# Altium schematic sheet [1]MCU.SchDoc
size B
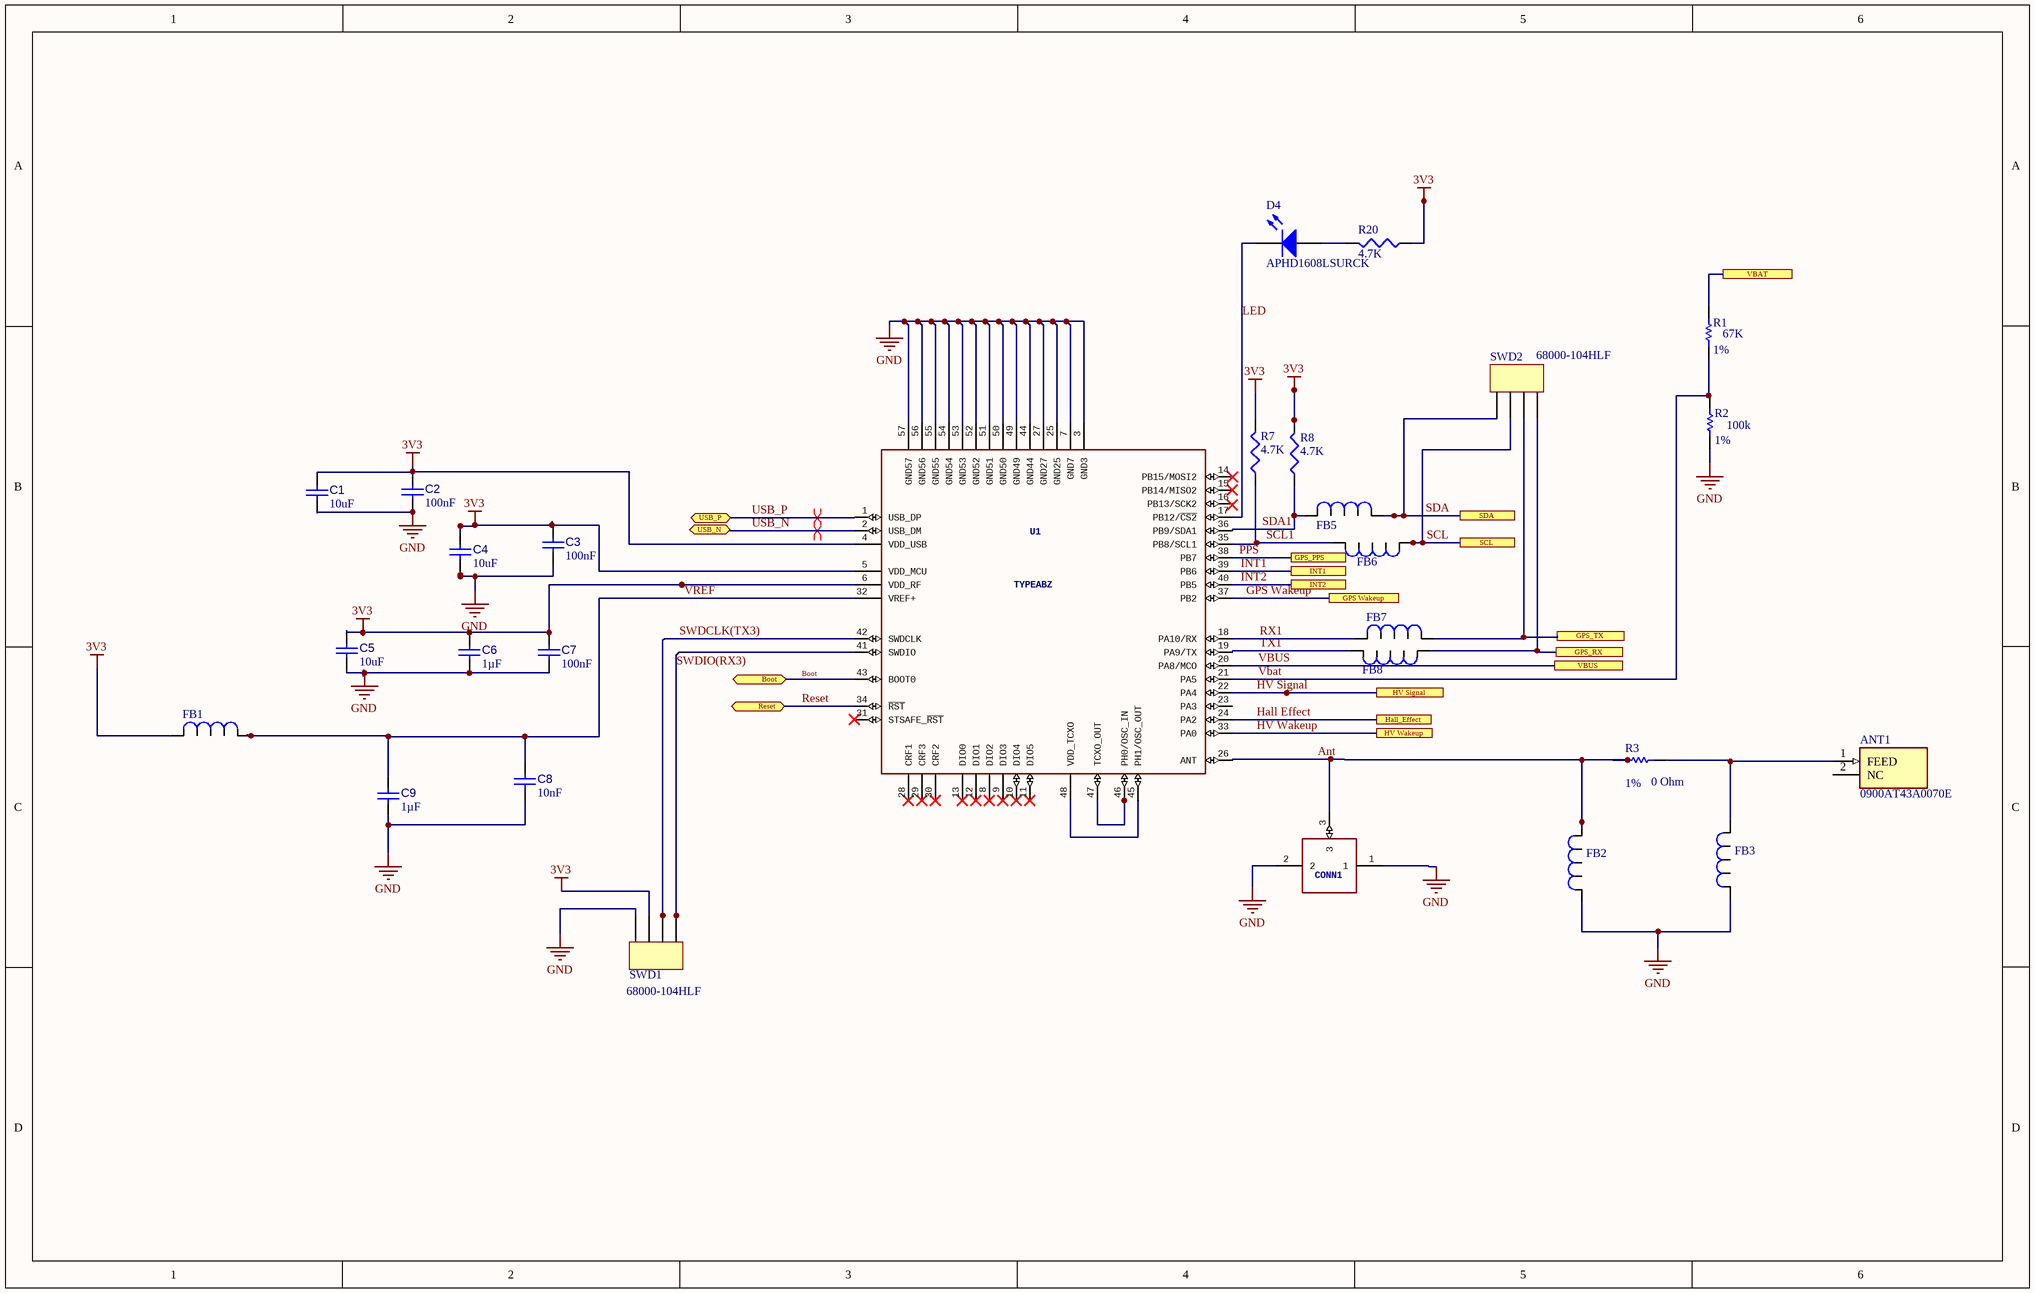
[diagram p0: [1]MCU.SchDoc]

## Parts
ANT1  0900AT43A0070E  [ANTC7020X90N]
C1  value 10uF  [CAPC1608X90X40ML10T20]  (hidden comment: Capacitor 10uF +/-10% 50 V 0603)
C2  value 100nF  [CAPC1608X90X40ML10T20]  (hidden comment: Capacitor 100 nF +/-10% 50 V 0603)
C3  value 100nF  [CAPC1608X90X40ML10T20]  (hidden comment: Capacitor 100 nF +/-10% 50 V 0603)
C4  value 10uF  [CAPC1608X90X40ML10T20]  (hidden comment: Capacitor 10uF +/-10% 50 V 0603)
C5  value 10uF  [CAPC1608X90X40ML10T20]  (hidden comment: Capacitor 10uF +/-10% 50 V 0603)
C6  value 1µF  [CAPC1608X90X40ML10T20]  (hidden comment: Capacitor 1 uF +/- 10% 25 V 0603)
C7  value 100nF  [CAPC1608X90X40ML10T20]  (hidden comment: Capacitor 100 nF +/-10% 50 V 0603)
C8  10nF  [CAPC1608X90X40ML10T20]
C9  value 1µF  [CAPC1608X90X40ML10T20]  (hidden comment: Capacitor 1 uF +/- 10% 25 V 0603)
CONN1  U.FL-R-SMT-1  [U.FL-R-SMT-1]  (value not drawn)
D4  APHD1608LSURCK  [LED BLUE CLEAR [0603] 2mA]
FB1  BLM18AG102SN1D  [Ferrite Bead]  (value not drawn)
FB2  BLM18AG102SN1D  [Ferrite Bead]  (value not drawn)
FB3  BLM18AG102SN1D  [Ferrite Bead]  (value not drawn)
FB5  BLM18AG102SN1D  [Ferrite Bead]  (value not drawn)
FB6  BLM18AG102SN1D  [Ferrite Bead]  (value not drawn)
FB7  BLM18AG102SN1D  [Ferrite Bead]  (value not drawn)
FB8  BLM18AG102SN1D  [Ferrite Bead]  (value not drawn)
R1  value 67K  Tolerance: 1%  [RES 0603]  (hidden comment: RES 67K 1% 0.1W [0603])
R2  value 100k  Tolerance: 1%  [RES 0603]  (hidden comment: RES 100K 5% 0.1W [0603])
R3  value 0 Ohm  Tolerance: 1%  [RESC0603]  (hidden comment: 0)
R7  4.7K  [RESC0603]
R8  4.7K  [RESC0603]
R20  4.7K  [RESC0603]
SWD1  68000-104HLF  [4POS_HEADER]
SWD2  68000-104HLF  [4POS_HEADER]
U1  TYPEABZ  [CMWX1ZZABZ]

## Ports
Boot (bidir), GPS Wakeup, GPS_PPS, GPS_RX, GPS_TX, Hall_Effect, HV Signal, HV Wakeup, INT1, INT2, Reset (bidir), SCL, SDA, USB_N (bidir), USB_P (bidir), VBAT, VBUS

## Nets
3V3: C1.2 C2.2 C3.2 C4.2 C5.2 C6.2 C7.2 FB1.2 R7.2 R8.2 R20.1 SWD1.2 U1.4(VDD_USB) U1.5(VDD_MCU) U1.6(VDD_RF)
GND: C1.1 C2.1 C3.1 C4.1 C5.1 C6.1 C7.1 C8.1 C9.2 CONN1.1 CONN1.2 FB2.2 FB3.2 R2.1 SWD1.1 U1.3(GND3) U1.7(GND7) U1.25(GND25) U1.27(GND27) U1.44(GND44) U1.49(GND49) U1.50(GND50) U1.51(GND51) U1.52(GND52) U1.53(GND53) U1.54(GND54) U1.55(GND55) U1.56(GND56) U1.57(GND57)
Ant: CONN1.3 FB2.1 R3.1 U1.26(ANT)
Boot: U1.43(BOOT0) ; port Boot
GPS Wakeup: U1.37(PB2) ; port GPS Wakeup
GPS_RX: FB8.1 SWD2.1 ; port GPS_RX
GPS_TX: FB7.1 SWD2.2 ; port GPS_TX
Hall Effect: U1.24(PA2) ; port Hall_Effect
HV Signal: U1.22(PA4) ; port HV Signal
HV Wakeup: U1.33(PA0) ; port HV Wakeup
INT1: U1.39(PB6) ; port INT1
INT2: U1.40(PB5) ; port INT2
LED: D4.1 U1.17(PB12/~{CS2})
PPS: U1.38(PB7) ; port GPS_PPS
Reset: U1.34(~{RST}) ; port Reset
RX1: FB7.2 U1.18(PA10/RX)
SCL: FB6.2 SWD2.3 ; port SCL
SCL1: FB6.1 R7.1 U1.35(PB8/SCL1)
SDA: FB5.1 SWD2.4 ; port SDA
SDA1: FB5.2 R8.1 U1.36(PB9/SDA1)
SWDCLK(TX3): SWD1.3 U1.42(SWDCLK)
SWDIO(RX3): SWD1.4 U1.41(SWDIO)
TX1: FB8.2 U1.19(PA9/TX)
USB_N: U1.2(USB_DM) ; port USB_N
USB_P: U1.1(USB_DP) ; port USB_P
Vbat: R1.1 R2.2 U1.21(PA5)
VBAT: R1.2 ; port VBAT  [a separate net that carries the same name]
VBUS: U1.20(PA8/MCO) ; port VBUS
VREF: C8.2 C9.1 FB1.1 U1.32(VREF+)
NetANT1_1: ANT1.1(FEED) FB3.1 R3.2
NetD4_2: D4.2 R20.2
NetU1_45: U1.45(PH1/OSC_OUT) U1.48(VDD_TCXO)
NetU1_46: U1.46(PH0/OSC_IN) U1.47(TCXO_OUT)

Not connected (* = marked no-connect by the designer): ANT1 2(NC); U1 8(DIO2)* 9(DIO3)* 10(DIO4)* 11(DIO5)* 12(DIO1)* 13(DIO0)* 14(PB15/MOSI2) 15(PB14/MISO2)* 16(PB13/SCK2) 23(PA3) 28(CRF1)* 29(CRF3)* 30(CRF2)* 31(STSAFE_~{RST})*

## Layout directives
differential pair; differential pair class USBPair: USB_N, USB_P

## Notes on the sheet
- Title
- Size:
- Date:
- A3
- Number:
- Time:
- Revision:
- Sheet
- of
- File:

## Library data of the parts
ANT1 = 0900AT43A0070E: Antenna; Manufacturer_Name: JOHANSON TECHNOLOGY; Datasheet Link: https://www.johansontechnology.com/datasheets/0900AT43A0070/0900AT43A0070.pdf; Height: 0.9mm; Manufacturer_Part_Number: 0900AT43A0070E
C1 C4 C5 = CMP-001-00017-4: Chip Capacitor, 10uF, +/- 10%, 50 V, 0603 (1608 Metric); Capacitor Type: Ceramic; Voltage Rating: 50V; RoHS Compliant: True; Max Operating Temperature: 125°C; Pins: 2; Mounting Technology: SM; Min Operating Temperature: -55°C; Tolerance: 10%; Case/Package: 0603
C2 C3 C7 = CMP-001-00017-4: Chip Capacitor, 100 nF, +/- 10%, 50 V, 0603 (1608 Metric); Capacitor Type: Ceramic; Voltage Rating: 50V; RoHS Compliant: True; Max Operating Temperature: 125°C; Pins: 2; Mounting Technology: SM; Min Operating Temperature: -55°C; Tolerance: 10%; Case/Package: 0603
C6 C9 = CMP-001-00005-4: Chip Capacitor, 1 uF, +/- 10%, 25 V, 0603 (1608 Metric); Voltage Rating: 25V; Capacitor Type: Ceramic; Min Operating Temperature: -55°C; Tolerance: 10%; Max Operating Temperature: 125°C; Case/Package: 0603; RoHS Compliant: True; Mounting Technology: SM; Pins: 2
C8 = CMP-001-00017-4: Chip Capacitor, 10 nF, +/- 10%, 50 V, 0603 (1608 Metric); Capacitor Type: Ceramic; Voltage Rating: 50V; RoHS Compliant: True; Value: 10nF; Max Operating Temperature: 125°C; Pins: 2; Mounting Technology: SM; Min Operating Temperature: -55°C; Tolerance: 10%; Case/Package: 0603
CONN1 = U.FL-R-SMT-1: GateName_1: G$1; SymbolName_1: U.FL-R-SMT-1; LibraryName: Kris; DeviceSetName: U.FL-R-SMT-1
D4 = LED BLUE CLEAR 1608 SMD: LED RED  [0603] 2mA; Datasheet: http://www.kingbrightusa.com/images/catalog/SPEC/APHD1608LQBC-D.pdf; Supplier 1: Digi-Key; Supplier Part Number 1: 754-2034-1-ND; PN: APHD1608LSURCK
FB1-FB3 FB5-FB8 = Ferrite Bead: Ferrite Bead 1KOhm @100MHz; Datasheet: https://www.murata.com/en-us/products/productdata/8796738650142/ENFA0003.pdf?src-supplier=Digi-Key; Supplier 1: Mouser; Supplier Part Number 1: 81-BLM11A102S; PN: BLM18AG102SN1D
R1 R2 = RES 3.3M 1% 0.1W [0603]: Supplier 1: Digi-Key; Supplier Part Number 1: 541-3.30MHCT-ND
R3 = RES 0 Ohm [0603]: RES 0 Ohm 1% 0.1W [0603]; Supplier 1: Mouser; Supplier Part Number 1: 667-ERJ-3GEY0R00V; Datasheet: http://industrial.panasonic.com/cdbs/www-data/pdf/RDA0000/AOA0000C301.pdf?src-supplier=Farnell
R7 R8 R20 = RESISTOR
SWD1 SWD2 = 68000-104HLF: 4 Positions Header, Unshrouded Connector 0.100" (2.54mm) Through Hole Gold or Gold, GXT™; Manufacturer 1: Amphenol FCI; Number of Positions: 4; Gender: Male; Connector Type: Male Pin; Voltage Rating: 1.5kV; Current Rating: 3A; Insulation Resistance: 5GR; Mating Post Length: 5.84mm; Mount: Through Hole; Colour: Black; Housing Colour: Black; Housing Material: Thermoplastic; Contact Plating: Nickel,Gold,GXT; Contact Material: Bronze; Min Operating Temperature: -65°C; Max Operating Temperature: 125°C; Number of Rows: 1; Packaging: Bulk; Package Quantity: 100; Termination: Solder; Number of Contacts: 4; Orientation: Straight; Max Voltage Rating (AC): 1.5kV; Contact Gender: Male; Length: 10.16mm; Pitch: 2.54mm; Depth: 2.41mm; Termination Post Length: 2.41mm; Contact Mating Length: 0.23inch; Radiation Hardening: No; REACH SVHC: No SVHC; Flammability Rating: UL94 V-0; ComponentLink1URL: https://datasheet.ciiva.com/16726/68000-16726213.pdf; ComponentLink1Description: https://datasheet.ciiva.com/16726/68000-16726213.pdf; ComponentLink2URL: https://datasheet.ciiva.com/10149/68000-10149830.pdf; ComponentLink2Description: https://datasheet.ciiva.com/10149/68000-10149830.pdf; ComponentLink3URL: https://datasheet.ciiva.com/46395/1914865-46395854.pdf; ComponentLink3Description: https://datasheet.ciiva.com/46395/1914865-46395854.pdf; ComponentLink4URL: https://datasheet.ciiva.com/728/68000-728879.pdf; ComponentLink4Description: https://datasheet.ciiva.com/728/68000-728879.pdf; Description 1: 4 Positions Header, Unshrouded Connector 0.100" (2.54mm) Through Hole Gold or Gold, GXT™; Manufacturer Part Number 1: 68000-104HLF; Pricing 1: 1=0.33, 10=0.316, 100=0.2212, 500=0.18964, 1000=0.15803, 5000=0.13545, 10000=0.12642 (USD); Stock 1: 10785; Supplier 1: Digi-Key; Supplier Part Number 1: 609-3248-ND
U1 = TYPEABZ: CMWX1ZZABZ-078; GateName_1: G$1; SymbolName_1: TYPEABZ; DeviceSetName: TYPEABZ